# Altium schematic sheet Sheet1.SchDoc
size A
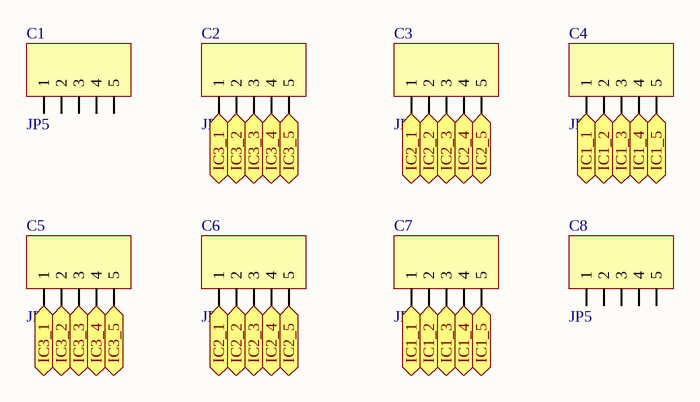
[diagram p0: Sheet1.SchDoc]

## Parts
C1  JP5  [JP5-D1T]
C2  JP5  [JP5-D1T]
C3  JP5  [JP5-D1T]
C4  JP5  [JP5-D1T]
C5  JP5  [JP5-D1T]
C6  JP5  [JP5-D1T]
C7  JP5  [JP5-D1T]
C8  JP5  [JP5-D1T]

## Ports
IC1_1, IC1_2, IC1_3, IC1_4, IC1_5, IC2_1, IC2_2, IC2_3, IC2_4, IC2_5, IC3_1, IC3_2, IC3_3, IC3_4, IC3_5

## Nets
IC1_1: C4.1 C7.1 ; port IC1_1
IC1_2: C4.2 C7.2 ; port IC1_2
IC1_3: C4.3 C7.3 ; port IC1_3
IC1_4: C4.4 C7.4 ; port IC1_4
IC1_5: C4.5 C7.5 ; port IC1_5
IC2_1: C3.1 C6.1 ; port IC2_1
IC2_2: C3.2 C6.2 ; port IC2_2
IC2_3: C3.3 C6.3 ; port IC2_3
IC2_4: C3.4 C6.4 ; port IC2_4
IC2_5: C3.5 C6.5 ; port IC2_5
IC3_1: C2.1 C5.1 ; port IC3_1
IC3_2: C2.2 C5.2 ; port IC3_2
IC3_3: C2.3 C5.3 ; port IC3_3
IC3_4: C2.4 C5.4 ; port IC3_4
IC3_5: C2.5 C5.5 ; port IC3_5

Not connected (* = marked no-connect by the designer): C1 1 2 3 4 5; C8 1 2 3 4 5

## Library data of the parts
C1-C8 = JP5: WR-PHD 2.54 mm Angled Socket Header; Manufacturer: W¨¹rth Elektronik eiSos GmbH; partNo: 613005143121; ComponentLink1 Description: Manufacturer; ComponentLink2 Description: Datasheet; NoPins: 05; Created Date: 29 March 2013; ComponentLink1URL: http://www.we-online.com; ComponentLink2URL: http://katalog.we-online.de/em/datasheet/6130xx143121.pdf; Created by: Karrer Zheng